# EAGLE design BOOSTXL-SENSORS (EAGLE 6.6.0)
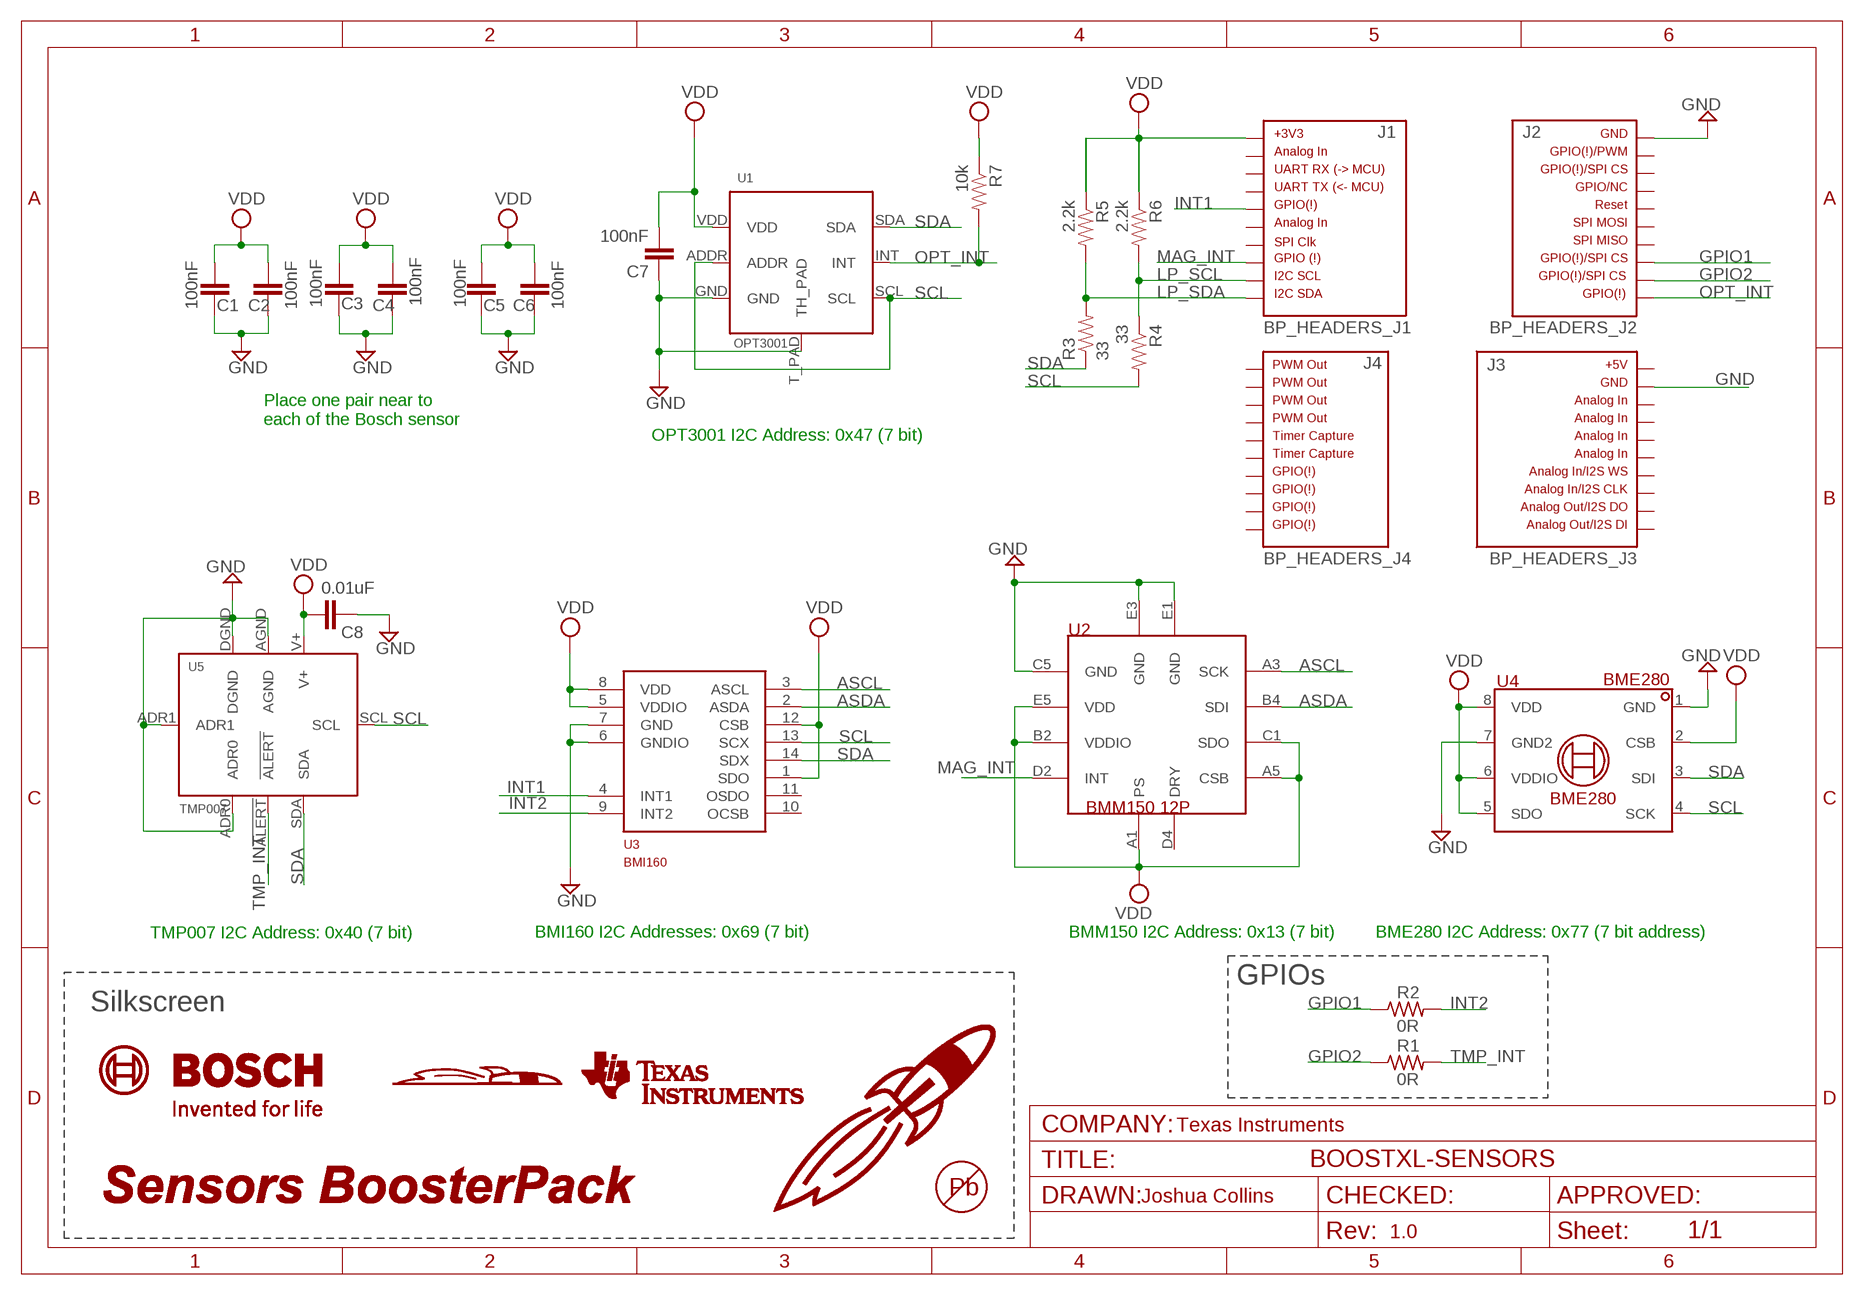
[diagram p0: schematic, sheet 1]

## Parts
C1  100nF  CAP0402-CAP  [0402-CAP]
C2  100nF  CAP0402-CAP  [0402-CAP]
C3  100nF  CAP0402-CAP  [0402-CAP]
C4  100nF  CAP0402-CAP  [0402-CAP]
C5  100nF  CAP0402-CAP  [0402-CAP]
C6  100nF  CAP0402-CAP  [0402-CAP]
C7  100nF  CAP0402-CAP  [0402-CAP]
C8  0.01uF  CAP0402-CAP  [0402-CAP]
J1  BP_HEADERS_J1  [J1]
J2  BP_HEADERS_J2  [J2]
J3  BP_HEADERS_J3  [J3]
J4  BP_HEADERS_J4  [J4]
R1  0R  RESR0603  [0603]
R2  0R  RESR0603  [0603]
R3  33  RESISTOR0402-RES  [0402-RES]
R4  33  RESISTOR0402-RES  [0402-RES]
R5  2.2k  RESISTOR0402-RES  [0402-RES]
R6  2.2k  RESISTOR0402-RES  [0402-RES]
R7  10k  RESISTOR0402-RES  [0402-RES]
U1  OPT3001  [OPT3001DNP]
U2  BMM150  [WLCSP12_1.56X1.56]
U3  BMI160  [LGA12_2.5X3.0]
U4  BME280  [LGA8_2.5X2.5]
U5  TMP007  [TMP007AIYZF]
U$1  BOSCH_LOGO_BOTTOM  [BOSCH_LOGO_BOTTOM]
U$2  HALF_ROCKET_BOTTOM_SILK  [HALF_ROCKET_LG]
U$3  ROCKET_45_MED_TOP_SILK  [ROCKET_45_MED_TOP_SILK]
U$4  SENSORS_BP_TOP_SILK  [SENSORS_BP]
U$5  TI_LOGO_LG_BOTTOM_SILK  [TI_LOGO_BOTTOMSILK]
U$6  PB-FREE  [PB-FREE]

## Nets
ASCL: U2.A3(SCK) U3.3(ASCL)
ASDA: U2.B4(SDI) U3.2(ASDA)
GND: C1.1 C2.1 C3.1 C4.1 C5.1 C6.1 C7.1 C8.1 J2.20 J3.22 U1.GND U1.T_PAD(TH_PAD) U2.C5(GND) U2.E1(GND) U2.E3(GND) U3.6(GNDIO) U3.7(GND) U4.1(GND) U4.7(GND2) U5.ADR0 U5.ADR1 U5.AGND U5.DGND
GPIO1: J2.13 R2.1
GPIO2: J2.12 R1.1
INT1: J1.5 U3.4(INT1)
INT2: R2.2 U3.9(INT2)
LP_SCL: J1.9 R4.1 R6.2
LP_SDA: J1.10 R3.2 R5.2
MAG_INT: J1.8 U2.D2(INT)
OPT_INT: J2.11 R7.2 U1.INT
SCL: R4.2 U1.ADDR U1.SCL U3.13(SCX) U4.4(SCK) U5.SCL
SDA: R3.1 U1.SDA U3.14(SDX) U4.3(SDI) U5.SDA
TMP_INT: R1.2 U5.!ALERT
VDD: C1.2 C2.2 C3.2 C4.2 C5.2 C6.2 C7.2 C8.2 J1.1 R5.1 R6.1 R7.1 U1.VDD U2.A1(PS) U2.A5(CSB) U2.B2(VDDIO) U2.C1(SDO) U2.E5(VDD) U3.1(SDO) U3.5(VDDIO) U3.8(VDD) U3.12(CSB) U4.2(CSB) U4.5(SDO) U4.6(VDDIO) U4.8(VDD) U5.V+
Unconnected: J1.2 J1.3 J1.4 J1.6 J1.7 J2.14 J2.15 J2.16 J2.17 J2.18 J2.19 J3.21 J3.23 J3.24 J3.25 J3.26 J3.27 J3.28 J3.29 J3.30 J4.31 J4.32 J4.33 J4.34 J4.35 J4.36 J4.37 J4.38 J4.39 J4.40 U2.D4(DRY) U3.10(OCSB) U3.11(OSDO)

## Notes on the sheet
- Place one pair near to 
  each of the Bosch sensor
- OPT3001 I2C Address: 0x47 (7 bit)
- BMM150 I2C Address: 0x13 (7 bit)
- TMP007 I2C Address: 0x40 (7 bit) | BMI160 I2C Addresses: 0x69 (7 bit) | BME280 I2C Address: 0x77 (7 bit address)
- GPIOs
- Silkscreen
- Texas Instruments
- Joshua Collins
- 1.0
- C:/GIT/BOOSTXL-SENSORS/SilkscreenImages/rocket.bmp

## Library data of the parts
C1-C8 = SparkFun:CAP: Capacitor Standard 0603 ceramic capacitor, and 0.1" leaded capacitor.
J1 = LaunchPad_Template_Library:BP_HEADERS_J1
J2 = LaunchPad_Template_Library:BP_HEADERS_J2
J3 = LaunchPad_Template_Library:BP_HEADERS_J3
J4 = LaunchPad_Template_Library:BP_HEADERS_J4
R1 R2 = MSP430_CapResistor:RES
R3-R7 = SparkFun:RESISTOR: Resistor Basic schematic elements and footprints for 0603, 1206, and PTH resistors.
U1 = MSP_IC:OPT3001
U2 = BST:BMM150: Bosch Sensortec Magnetometer BMM150
U3 = BST:BMI160: Bosch Sensortec IMU BMI160
U4 = BST:BME280: Bosch Sensortec BME280
U5 = MSP_IC:TMP007
U$1 = LaunchPad_Template_Library:BOSCH_LOGO_BOTTOM
U$2 = LaunchPad_Template_Library:HALF_ROCKET_BOTTOM_SILK
U$3 = LaunchPad_Template_Library:ROCKET_45_MED_TOP_SILK
U$4 = LaunchPad_Template_Library:SENSORS_BP_TOP_SILK
U$5 = LaunchPad_Template_Library:TI_LOGO_LG_BOTTOM_SILK
U$6 = LaunchPad_Template_Library:PB-FREE

## Board
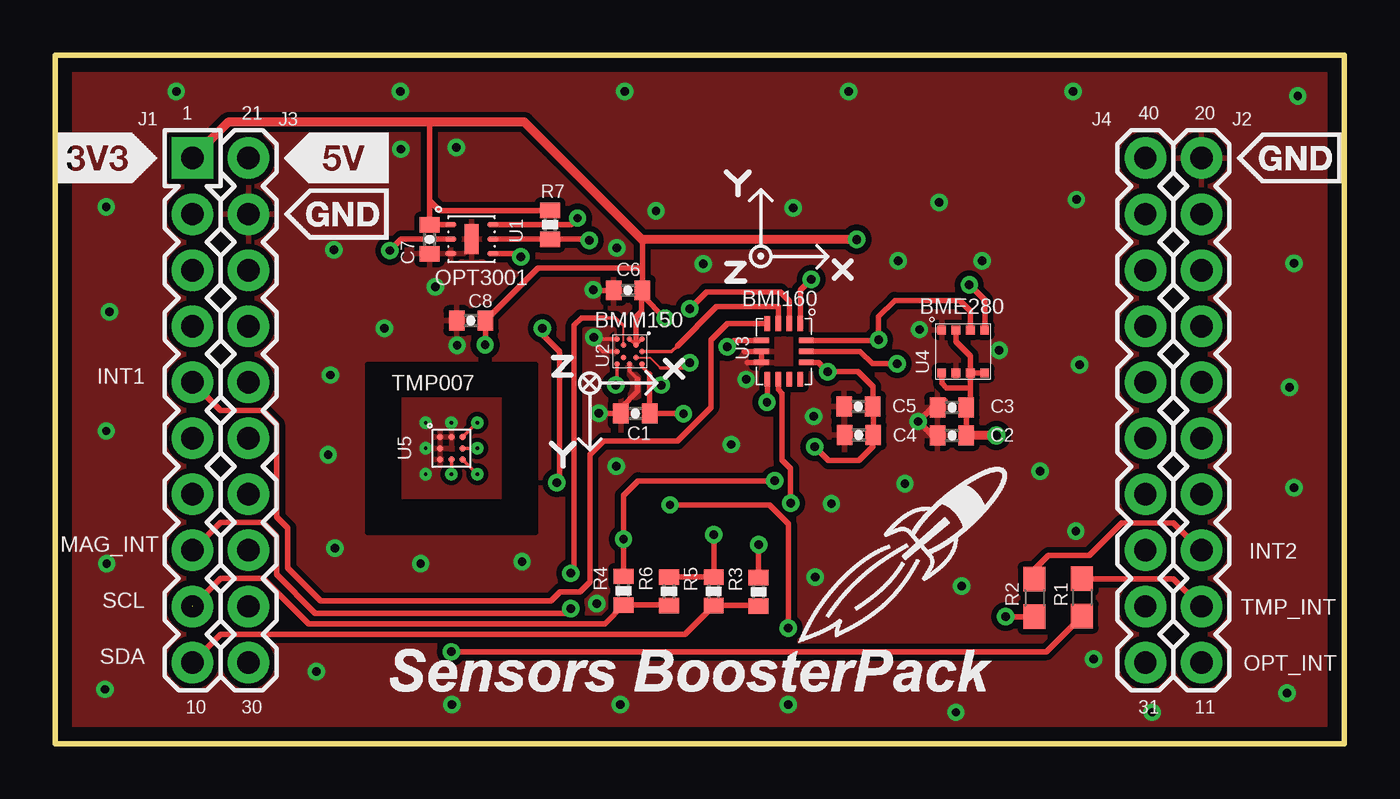
[diagram p1: board, top side]
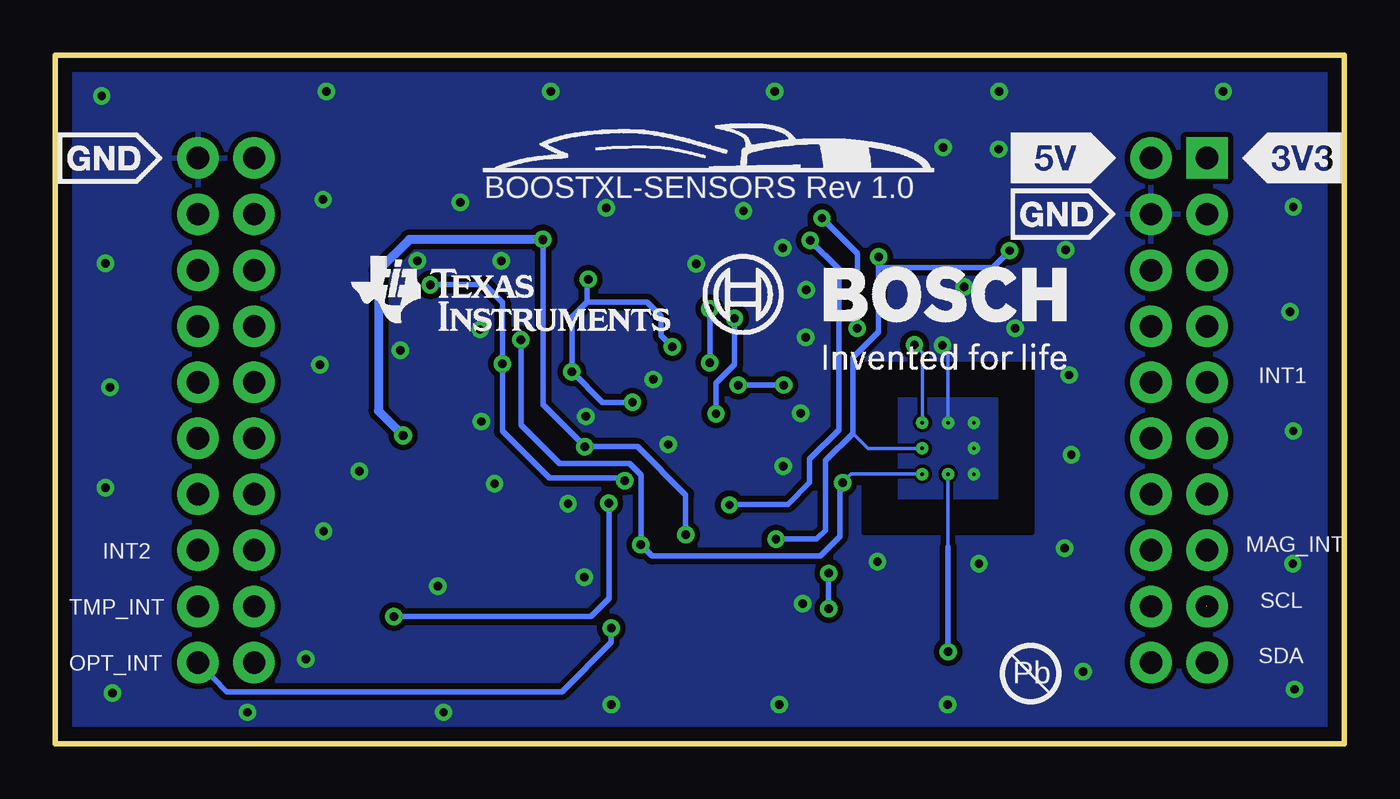
[diagram p2: board, bottom side, seen from below]

Size 58.42 x 31.21 mm. Coordinates in mm from the lower left corner, seen from the top.
Outline: 0,31.21 58.42,31.21 58.42,0 0,0 0,31.21
Copper layers (1*16): Top 0.035mm / dielectric 1.5mm / Bottom 0.035mm
Design rules "default *": minimum track width 4mil, minimum drill 15mil, track to track 6mil, track to pad 6mil, pad to pad 6mil, via to via 6mil, smd to smd 0mil, copper to edge 25mil, drill to drill 15mil, minimum pad ring 10mil, minimum via ring 8mil, stop-mask expansion 4mil, vias tented up to drill 24mil, thermal gap 10mil

### Footprints (pad centres in the part's own frame; a part is rotated, then mirrored left to right if it is on the bottom)
0402-CAP = smd 0.7 x 0.9: 1 -0.65,0; 2 0.65,0
J1 = drill 1.016 pad 1.88 square: 1 0,22.86 | drill 1.016 pad 1.88: 2 0,20.32; 3 0,17.78; 4 0,15.24; 5 0,12.7; 6 0,10.16; 7 0,7.62; 8 0,5.08; 9 0,2.54; 10 0,0
J2 = drill 1.016 pad 1.88: 11 0,0; 12 0,2.54; 13 0,5.08; 14 0,7.62; 15 0,10.16; 16 0,12.7; 17 0,15.24; 18 0,17.78; 19 0,20.32; 20 0,22.86
J3 = drill 1.016 pad 1.88: 21 0,22.86; 22 0,20.32; 23 0,17.78; 24 0,15.24; 25 0,12.7; 26 0,10.16; 27 0,7.62; 28 0,5.08; 29 0,2.54; 30 0,0
J4 = drill 1.016 pad 1.88: 31 0,0; 32 0,2.54; 33 0,5.08; 34 0,7.62; 35 0,10.16; 36 0,12.7; 37 0,15.24; 38 0,17.78; 39 0,20.32; 40 0,22.86
0603 = smd 1.1 x 1: 1 -0.85,0; 2 0.85,0
0402-RES = smd 0.7 x 0.9: 1 -0.65,0; 2 0.65,0
OPT3001DNP = smd 0.5 x 0.25: ADDR -0.95,0; GND -0.95,-0.65; INT 0.95,0; SCL 0.95,-0.65; SDA 0.95,0.65; VDD -0.95,0.65 | smd 0.65 x 1.35: T_PAD 0,0
WLCSP12_1.56X1.56 = smd 0.25 x 0.25: A1 0.566,0.566; A3 0.566,0; A5 0.566,-0.566; B2 0.283,0.283; B4 0.283,-0.283; C1 0,0.566; C5 0,-0.566; D2 -0.283,0.283; D4 -0.283,-0.283; E1 -0.566,0.566; E3 -0.566,0; E5 -0.566,-0.566
LGA12_2.5X3.0 = smd 0.675 x 0.25: 1 -1.262,0.75; 2 -1.262,0.25; 3 -1.262,-0.25; 4 -1.262,-0.75; 8 1.262,-0.75; 9 1.262,-0.25; 10 1.262,0.25; 11 1.262,0.75 | smd 0.25 x 0.675: 5 -0.5,-1.012; 6 0,-1.012; 7 0.5,-1.012; 12 0.5,1.012; 13 0,1.012; 14 -0.5,1.012
LGA8_2.5X2.5 = smd 0.4 x 0.4: 1 -0.975,0.975; 2 -0.325,0.975; 3 0.325,0.975; 4 0.975,0.975; 5 0.975,-0.975; 6 0.325,-0.975; 7 -0.325,-0.975; 8 -0.975,-0.975
TMP007AIYZF = smd 0.305 x 0.305: !ALERT 0,-0.508; ADR0 -0.508,-0.508; ADR1 -0.508,0; AGND 0,0.508; DGND -0.508,0.508; SCL 0.508,0; SDA 0.508,-0.508; V+ 0.508,0.508

### Placement (x,y rotation side)
C1  26.29,14.96 0 top
C2  40.64,13.97 0 top
C3  40.64,15.24 0 top
C4  36.42,14 0 top
C5  36.4,15.29 0 top
C6  25.96,20.55 0 top
C7  16.97,22.86 90 top
C8  18.85,19.18 0 top
J1  6.22,3.68 0 top
J2  51.94,3.68 0 top
J3  8.76,3.68 0 top
J4  49.4,3.68 0 top
R1  46.53,6.63 270 top
R2  44.37,6.6 270 top
R3  31.88,6.88 270 top
R4  25.76,6.93 90 top
R5  29.85,6.91 270 top
R6  27.81,6.91 270 top
R7  22.43,23.52 270 top
U1  18.87,22.87 0 top
U2  26.04,17.78 0 top
U3  33.02,17.78 270 top
U4  41.15,17.78 0 top
U5  17.96,13.39 0 top
U$1  11.94,16.39 0 top
U$2  18.59,25.89 0 top
U$3  33.33,4.11 0 top
U$4  14.82,2.05 0 top
U$5  30.16,18.49 0 top
U$6  12.95,1.91 0 top

### Tracks (layer width: path | path; a pad name or v marks a point on that pad's centre or on a via)
ASCL
  Top 0.152: U2.A3 27.94,17.78 28.19,18.03
  Top 0.254: 28.19,18.03 29.97,19.81 32.77,19.81 U3.3
ASDA  (via drill 0.38)
  Top 0.102: U2.B4 26.95,17.5 27.43,17.02
  Top 0.152: 27.43,17.02 28.5,17.02 v28.75,17.27
  Top 0.254: v28.75,19.71 29.52,20.47 32.87,20.47 33.27,20.07 33.27,20.06 U3.2
  Bottom 0.254: v28.75,17.27 v28.75,19.71
GND  (via drill 0.15 pad 0.3, 0.38)
  Top 0.152: U2.E3 24.82,17.78 24.25,18.35 | U2.C5 26.04,16.89 26.4,16.53 | 24.25,18.35 24.21,18.35 | U2.E1 24.25,18.35
  Top 0.254: C2.1 39.75,13.97 v39.12,14.6 39.75,15.24 C3.1 40.31,15.56 | 24.21,18.35 24.19,18.35 v24.41,18.42 | C6.1 24.41,20.55 v24.38,20.57 | v24.64,14.99 24.66,14.96 C1.1 25.64,15.22 26.4,15.99 26.4,16.53 | 31.24,17.78 U3.6 U3.7 31.38,17.28 31.37,17.27
  Bottom 0.152: v17.96,14.55 17.96,17.91 17.93,17.93
  Bottom 0.254: 17.93,17.93 18.16,18.16
  other vias: 16.79,14.55 16.79,12.22 16.79,13.39 17.22,20.7 34.37,14.83 31.32,16.51 25.43,12.57 30.63,13.56 29.36,21.74 25.45,22.48 38.2,21.89 18.19,27.03 39.17,18.77 5.49,29.57 15.65,29.57 25.81,29.57 35.97,29.57 46.13,29.57 38.51,11.79 35.18,10.87 34.44,7.54 46.25,9.63 12.67,8.86 21.16,8.25 12.47,16.71 18.21,18.06 2.31,24.33 2.31,14.17 2.26,2.46 55.83,2.29 56.13,11.61 56.13,21.77 33.22,1.78 25.6,1.78 17.98,1.78 11.84,3.28 47.07,3.84 46.43,17.17 14.91,18.82 15.67,26.95 12.62,22.38 16.56,8.15 12.37,13.11 41.07,7.14 44.63,12.34 46.28,24.66 56.31,29.36 55.93,16.15 40.06,24.54 33.45,24.28 27.23,24.16 2.46,19.58 2.34,8.15 40.82,1.42 49.71,1.42 24.54,6.35 42.01,21.89 42.77,17.83
  pour Bottom (isolate 0.254): 0,31.21 58.42,31.21 58.42,0 0,0
  pour Top (isolate 0.203): 15.67,15.67 20.24,15.67 20.24,11.1 15.67,11.1
  pour Bottom: 15.67,15.67 20.24,15.67 20.24,11.1 15.67,11.1
  pour Top (isolate 0.254): 0,31.21 58.42,31.21 58.42,0 0,0
GPIO1
  Top 0.254: R2.1 44.38,7.9 45.01,8.53 46.86,8.53 48.34,10.01 50.67,10.01 J2.13
GPIO2
  Top 0.254: R1.1 50.66,7.48 50.67,7.47 J2.12
INT1
  Top 0.254: U3.4 30.47,19.04 29.72,18.29 29.72,15.24 28.19,13.72 24.84,13.72 24.23,13.11 24.23,7.34 23.77,6.88 22.89,6.88 22.48,6.48 12.04,6.48 10.54,7.98 10.54,9.78 10.03,10.29 10.03,14.48 9.4,15.11 7.49,15.11 J1.5
INT2  (via drill 0.38)
  Top 0.254: U3.9 32.77,16.05 32.94,15.87 32.94,12.85 33.32,12.47 v33.32,10.9 | R2.2 v43.09,5.75 v43.08,5.77
  Bottom 0.254: v43.08,5.77 34.14,5.77 33.32,6.58 v33.32,10.9
LP_SCL  (1 unrouted)
  Top 0.254: 27.33,6.28 R6.2 27.79,6.28 R4.1 | R4.1 | 6.22,6.25 6.25,6.25 | R4.1 24.91,5.44 11.48,5.44 9.42,7.49 7.49,7.49 J1.9
LP_SDA
  Top 0.254: R3.2 31.85,6.26 R5.2 28.54,4.95 7.49,4.95 J1.10
MAG_INT  (via drill 0.38)
  Top 0.102: U2.D2 25.75,18.95
  Top 0.152: 25.75,18.95 25.4,19.3 24.89,19.3
  Top 0.254: 24.89,19.3 23.85,19.3 23.52,18.97 23.52,7.87 v23.37,7.72 | v23.37,6.12 23.17,5.92 11.79,5.92 10.03,7.67 10.03,9.4 9.4,10.03 7.49,10.03 J1.8
  Bottom 0.254: v23.37,6.12 v23.37,7.72
N$1
  cutout Bottom: 14.15,17.2 14.15,9.58 21.77,9.58 21.77,17.2 15.67,17.2 15.7,17.2 15.7,15.82 20.37,15.8 20.37,10.95 15.57,10.95 15.57,17.2
  cutout Top: 14.15,17.2 14.15,9.58 21.77,9.58 21.77,17.2 15.67,17.2 15.7,17.2 15.7,15.82 20.37,15.8 20.37,10.95 15.57,10.95 15.57,17.2
OPT_INT  (via drill 0.38)
  Top 0.254: v27.86,10.82 32.36,10.82 33.22,9.96 v33.22,5.23 | 22.42,22.86 R7.2 | R7.2 24.14,22.87 v24.21,22.81 | U1.INT R7.2
  Bottom 0.254: v27.86,10.82 27.84,10.85 25.22,10.85 24.23,11.84 24.23,12.9 22.91,14.22 22.91,21.51 v24.21,22.81 | v33.22,5.23 33.22,4.6 35.46,2.36 50.65,2.36 J2.11
SCL  (via drill 0.15 pad 0.3, 0.38)
  Top 0.152: U5.SCL v19.13,13.39
  Top 0.254: R4.2 v25.76,9.27 25.76,11.25 26.42,11.91 v32.61,11.91 | U3.13 36.47,17.78 37.03,17.22 v38.15,17.22 | U4.4 42.12,20.11 v41.43,20.8 | v15.16,22.35 15.68,22.87 U1.ADDR | 20.97,22.21 v21.11,22.07 20.96,22.22 U1.SCL
  Bottom 0.152: 22.28,14.07 21.59,13.39 v19.13,13.39
  Bottom 0.254: v25.76,9.27 23.93,9.27 23.52,9.68 23.52,12.83 22.28,14.07 22.28,17.5 21.11,18.67 21.11,21.69 | v41.43,20.8 38.96,20.8 38.15,19.99 v38.15,17.22 38.15,14.17 36.02,12.04 32.74,12.04 v32.61,11.91 | v15.16,22.35 15.93,21.59 21.01,21.59 21.11,21.69 | 21.11,21.69 v21.11,22.07
SDA  (via drill 0.15 pad 0.3, 0.38)
  Top 0.152: U5.SDA v19.13,12.22
  Top 0.254: v22.07,18.82 22.07,18.57 22.86,17.78 22.86,11.96 v22.73,11.84 | U3.14 37.28,18.28 v37.31,18.31 37.31,19.36 38.05,20.09 41,20.09 41.47,19.61 U4.3 | R3.1 v31.88,9.02 | U1.SDA 23.37,23.52 v23.67,23.83
  Bottom 0.152: v19.13,12.22 22.35,12.22 v22.73,11.84
  Bottom 0.254: 22.68,11.89 v22.73,11.84 22.86,11.71 22.86,9.4 23.75,8.51 31.37,8.51 v31.88,9.02 31.88,12.19 32.38,12.7 35.56,12.7 37.31,14.45 v37.31,18.31 | v22.07,18.82 22.07,22.23 v23.67,23.83
TMP_INT  (via drill 0.15 pad 0.3, 0.38)
  Top 0.152: U5.!ALERT v17.96,12.22
  Top 0.254: v17.96,4.17 44.92,4.17 R1.2
  Bottom 0.152: v17.96,12.22 17.96,8.91
  Bottom 0.254: 17.96,8.91 v17.96,4.17
VDD  (via drill 0.15 pad 0.3, 0.38, 0.41)
  Top 0.152: U2.E5 25.47,16.33 v25.4,16.26 | U2.A5 26.6,17.09 26.92,16.76 | U2.C1 U2.B2 U2.A1 | U5.V+ 18.47,13.94 18.52,13.94 v19.13,14.55
  Top 0.254: U4.6 U4.5 | C2.2 C3.2 41.47,15.42 41.47,16.13 | U2.B2 26.32,19.33 26.57,19.58 26.57,20.51 C6.2 | C6.2 26.61,21.54 | 26.61,21.54 26.61,22.84 | R6.1 R5.1 v29.85,9.47 | 35.04,16.91 v35,16.87 | U3.12 34.59,17.28 v35,16.87 | 26.61,21.54 26.58,21.57 21.88,21.57 C8.2 19.5,18.1 v19.48,18.09 | v34.27,21.06 33.77,20.56 U3.1 | v34.42,13.46 35.05,12.83 36.42,12.83 37.06,13.46 37.06,13.98 C4.2 37.07,15.26 C5.2 37.05,16.19 36.37,16.87 v35,16.87 | U3.8 32.27,15.48 v32.26,15.47 | 15.75,28.14 15.8,28.19 | U3.5 30.75,18.28 v30.46,17.98 | U4.8 40.17,16.34 40.39,16.13 41.47,16.13 | U4.6 41.47,16.13 | U4.2 40.82,18.23 41.47,17.58 U4.6 | 16.97,24.61 C7.2 16.98,23.52 U1.VDD | 16.97,24.61 16.97,28.17 16.99,28.19 | R7.1 17.41,24.17 16.97,24.61 | C6.2 26.61,20.3 v27.64,19.28 | 26.92,14.98 28.46,14.98 v28.47,14.96 | 26.92,16.76 26.92,16.38 | 26.92,16.38 26.92,14.98 | 26.92,14.98 C1.2 | v27.46,16.26 27.05,16.26 26.92,16.38
  Top 0.406: v36.32,22.86 26.63,22.86 26.61,22.84 21.25,28.19 16.99,28.19 15.8,28.19 7.87,28.19 J1.1 | v42.65,13.97 C2.2
  Bottom 0.152: v19.13,14.55 19.13,17.73 v19.48,18.09
  Bottom 0.254: v25.4,16.26 v27.46,16.26 | 34.31,20.02 35,19.33 v35,16.87 33.6,15.47 v32.26,15.47 | 34.31,20.02 31.6,20.02 30.96,19.38 30.96,18.49 v30.46,17.98 | 34.31,20.02 34.31,21.01 v34.27,21.06 | v36.32,22.86 36.32,15.37 v34.42,13.46 32.03,13.46 29.85,11.28 v29.85,9.47 | v27.64,19.28 27.64,17.2 28.47,16.36 v28.47,14.96
  Bottom 0.406: 42.67,13.99 v42.65,13.97 43.76,15.09 43.76,21.46 42.37,22.86 v36.32,22.86

### Text on the board
tPlace: U1 | OPT3001 | U2 | INT1 | TMP007 | MAG_INT | INT2 | SCL | TMP_INT | SDA | Joshua Collins | OPT_INT
bPlace: BOOSTXL-SENSORS Rev 1.0 | INT1 | MAG_INT | INT2 | SCL | TMP_INT | SDA | OPT_INT